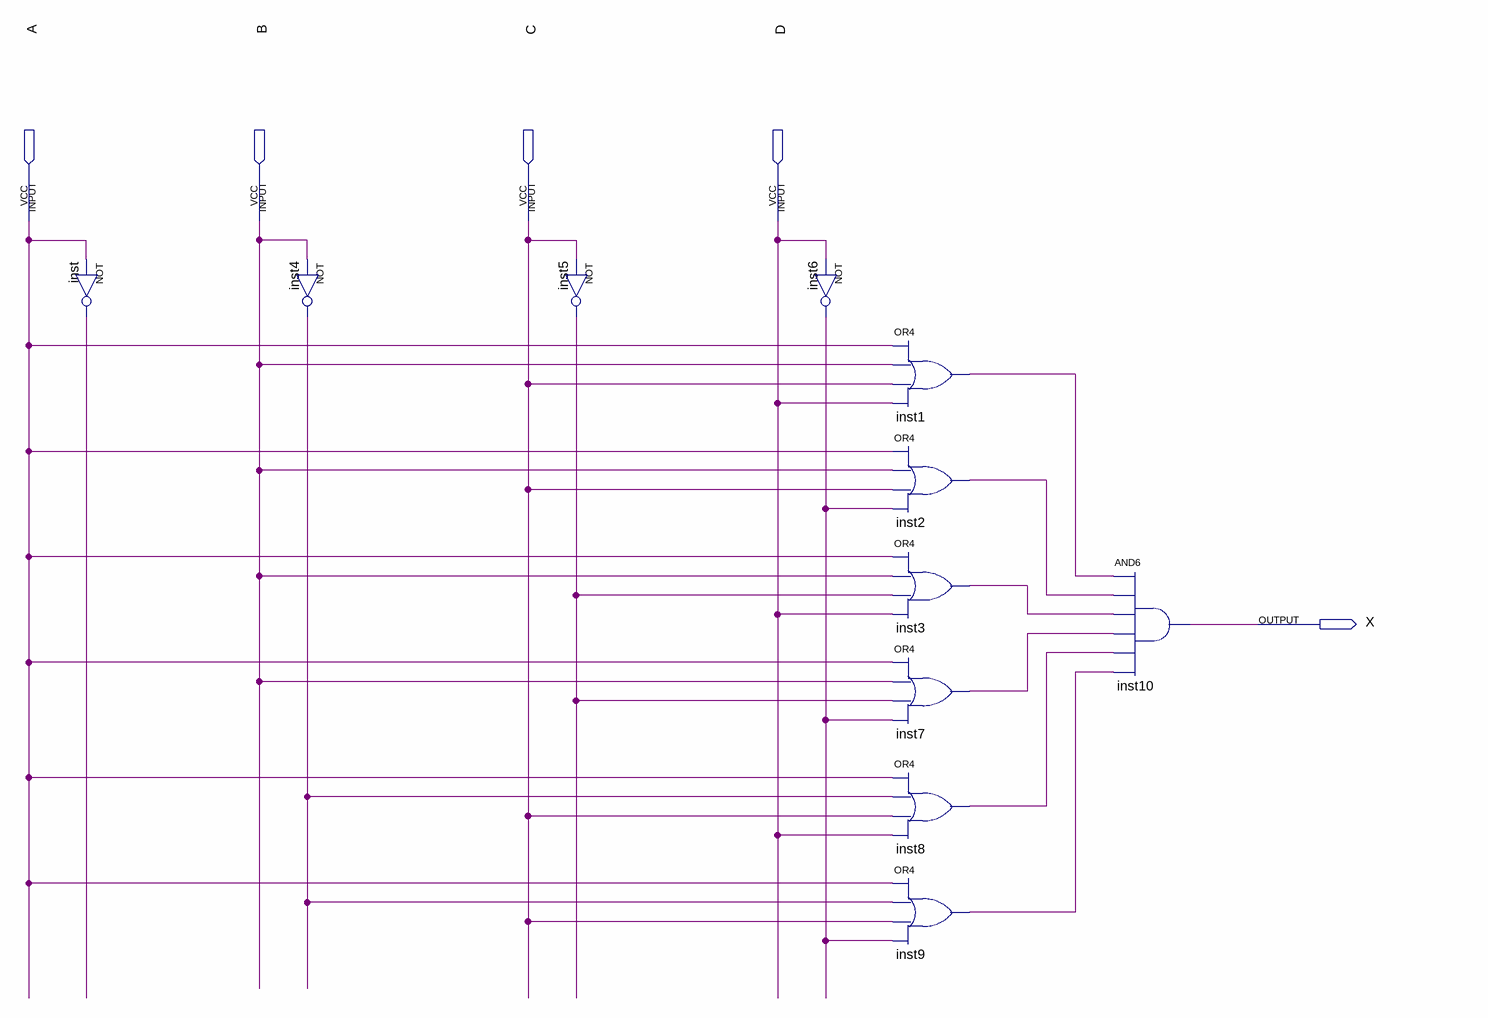
[diagram p0: schematic sheet]
// Quartus schematic POS.bdf as structural Verilog: 11 symbols, 5 pins
module POS (
  input  A,
  input  B,
  input  C,
  input  D,
  output X
);

  wire inst1_out, inst2_out, inst3_out, inst4_out, inst5_out, inst6_out, inst7_out, inst8_out, inst9_out,
       inst_out;

  not inst (inst_out, A);
  not inst4 (inst4_out, B);
  not inst5 (inst5_out, C);
  not inst6 (inst6_out, D);
  or inst1 (inst1_out, A, B, C, D);
  or inst2 (inst2_out, A, B, C, inst6_out);
  or inst3 (inst3_out, A, B, inst5_out, D);
  or inst7 (inst7_out, A, B, inst5_out, inst6_out);
  or inst8 (inst8_out, A, inst4_out, C, D);
  or inst9 (inst9_out, A, inst4_out, C, inst6_out);
  and inst10 (X, inst1_out, inst2_out, inst3_out, inst7_out, inst8_out, inst9_out);
endmodule
